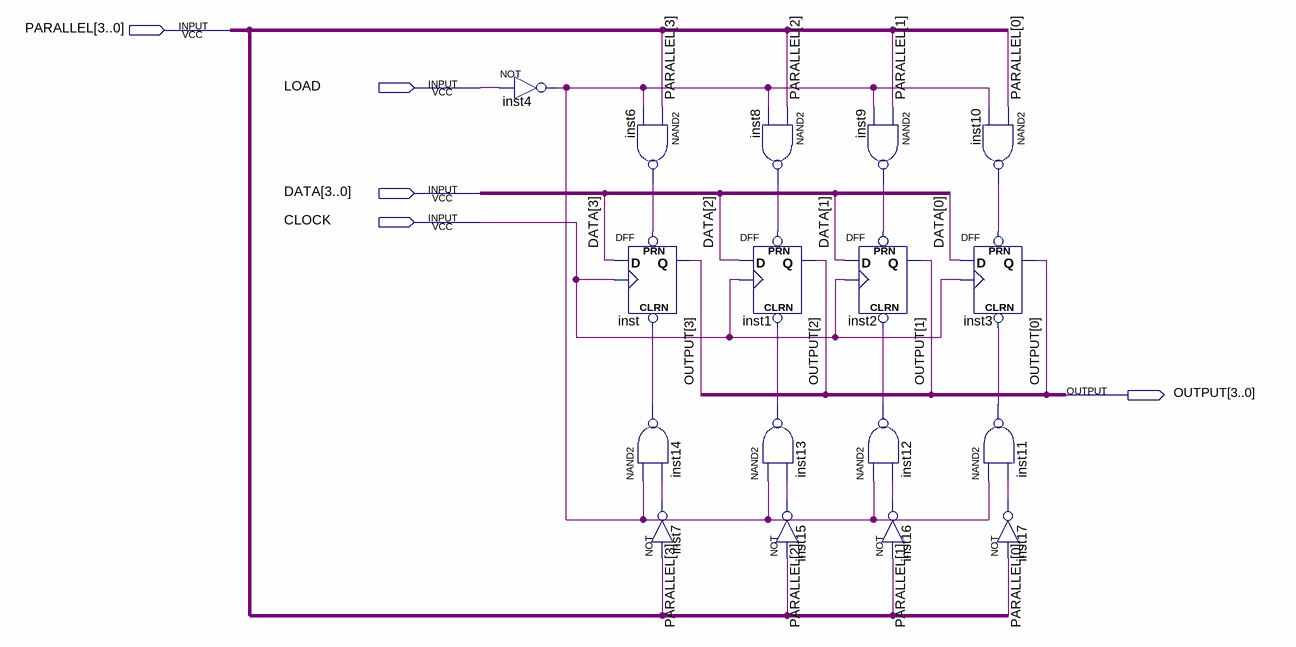
[diagram p0: schematic sheet]
// Quartus schematic REGISTER_4BIT.bdf as structural Verilog: 17 symbols, 5 pins
module REGISTER_4BIT (
  input  [3:0] PARALLEL,
  input  LOAD,
  input  [3:0] DATA,
  input  CLOCK,
  output [3:0] OUTPUT
);

  wire inst4_out, inst6_out, inst7_out, inst8_out, inst9_out, inst10_out, inst11_out, inst12_out, inst13_out,
       inst14_out, inst15_out, inst16_out, inst17_out;

  not inst4 (inst4_out, LOAD);
  nand inst6 (inst6_out, PARALLEL[3], inst4_out);
  DFF inst (.CLRN(inst14_out), .CLK(CLOCK), .D(DATA[3]), .PRN(inst6_out), .Q(OUTPUT[3]));
  nand inst14 (inst14_out, inst4_out, inst7_out);
  not inst7 (inst7_out, PARALLEL[3]);
  nand inst8 (inst8_out, PARALLEL[2], inst4_out);
  DFF inst1 (.CLRN(inst13_out), .CLK(CLOCK), .D(DATA[2]), .PRN(inst8_out), .Q(OUTPUT[2]));
  nand inst13 (inst13_out, inst4_out, inst15_out);
  not inst15 (inst15_out, PARALLEL[2]);
  nand inst9 (inst9_out, PARALLEL[1], inst4_out);
  DFF inst2 (.CLRN(inst12_out), .CLK(CLOCK), .D(DATA[1]), .PRN(inst9_out), .Q(OUTPUT[1]));
  nand inst12 (inst12_out, inst4_out, inst16_out);
  not inst16 (inst16_out, PARALLEL[1]);
  nand inst10 (inst10_out, PARALLEL[0], inst4_out);
  DFF inst3 (.CLRN(inst11_out), .CLK(CLOCK), .D(DATA[0]), .PRN(inst10_out), .Q(OUTPUT[0]));
  nand inst11 (inst11_out, inst4_out, inst17_out);
  not inst17 (inst17_out, PARALLEL[0]);
endmodule
